# Altium schematic sheet Sheet1.SchDoc
size A4
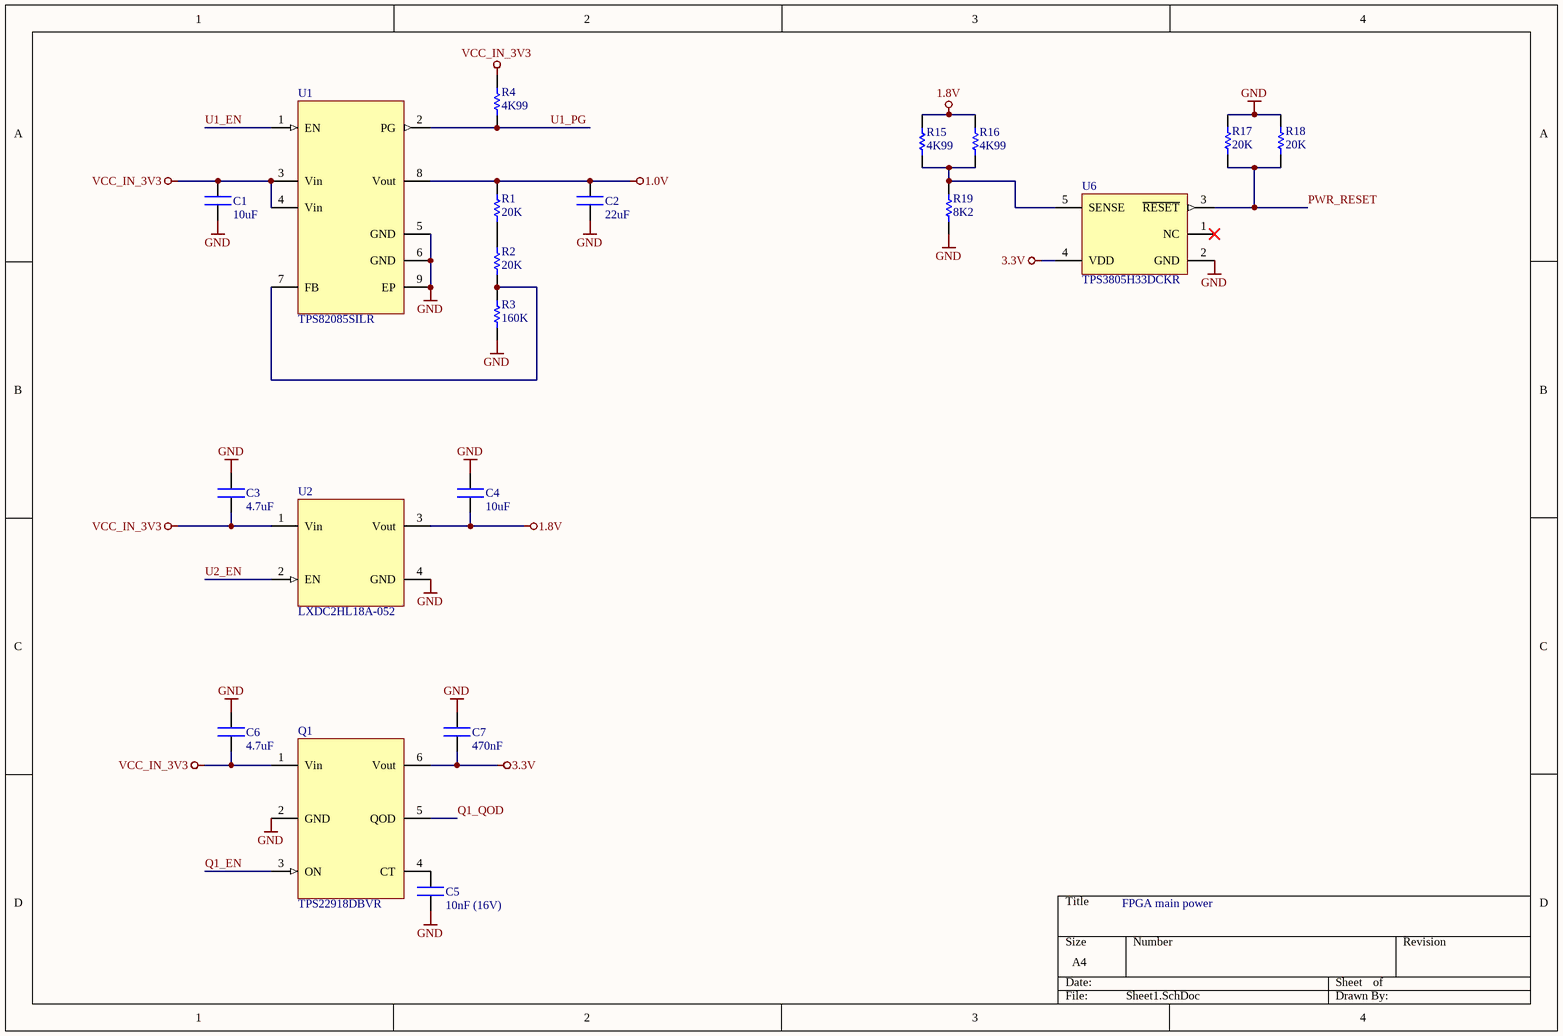
[diagram p0: Sheet1.SchDoc]

## Parts
C1  10uF  [CAPC1608X08N]
C2  22uF  [CAPC1608X08N]
C3  4.7uF  [CAPC1005X05N]
C4  10uF  [CAPC1608X08N]
C5  10nF (16V)  [CAPC1005X05N]
C6  4.7uF  [CAPC1005X05N]
C7  470nF  [CAPC1005X05N]
Q1  TPS22918DBVR  [TPS22918DBVR]
R1  20K  [RESC1005X05N]
R2  20K  [RESC1005X05N]
R3  160K  [RESC1005X05N]
R4  4K99  [RESC1005X05N]
R15  4K99  [RESC1005X05N]
R16  4K99  [RESC1005X05N]
R17  20K  [RESC1005X05N]
R18  20K  [RESC1005X05N]
R19  8K2  [RESC1005X05N]
U1  TPS82085SILR  [TPS82085SILR]
U2  LXDC2HL18A-052  [LXDC2HL18A-052]
U6  TPS3805H33DCKR  [TPS3805H33DCKR]

## Nets
1.0V: C2.2 R1.2 U1.8(Vout)
1.8V: C4.2 R15.2 R16.2 U2.3(Vout)
3.3V: C7.2 Q1.6(Vout) U6.4(VDD)
GND: C1.1 C2.1 C3.1 C4.1 C5.1 C6.1 C7.1 Q1.2(GND) R3.1 R17.1 R18.1 R19.1 U1.5(GND) U1.6(GND) U1.9(EP) U2.4(GND) U6.2(GND)
VCC_IN_3V3: C1.2 C3.2 C6.2 Q1.1(Vin) R4.2 U1.3(Vin) U1.4(Vin) U2.1(Vin)
PWR_RESET: R17.2 R18.2 U6.3(~{RESET})
Q1_EN: Q1.3(ON)
Q1_QOD: Q1.5(QOD)
U1_EN: U1.1(EN)
U1_PG: R4.1 U1.2(PG)
U2_EN: U2.2(EN)
NetC5_2: C5.2 Q1.4(CT)
NetR1_1: R1.1 R2.2
NetR2_1: R2.1 R3.2 U1.7(FB)
NetR15_1: R15.1 R16.1 R19.2 U6.5(SENSE)

Not connected (* = marked no-connect by the designer): U6 1(NC)*

## Notes on the sheet
- FPGA main power

## Library data of the parts
C1 C2 C4 = C0603: Ceramic Chip Capacitor
  C1 C4: Value: 10uF
  C2: Value: 22uF
C3 C5-C7 = C0402: Ceramic Chip Capacitor
  C3 C6: Value: 4.7uF
  C5: Value: 10nF (16V)
  C7: Value: 470nF
Q1 = TPS22918DBVR: 5.5-V, 2-A, 52-mΩ On-Resistance Load Switch
R1-R4 R15-R19 = R0402: Ceramic Chip Resistor
  R1 R2 R17 R18: Value: 20K
  R3: Value: 160K
  R4 R15 R16: Value: 4K99
  R19: Value: 8K2
U1 = TPS82085SILR: 3-A High Efficiency Step-Down Converter
U2 = LXDC2HL18A-052: Low power step-down DC-DC converter.
U6 = TPS3805H33DCKR: Dual Voltage Detector, 2 Supply Monitored, -40 to 85 degC, 5-pin SC70 (DCK), Green (RoHS & no Sb/Br); Manufacturer: Texas Instruments; # of supplies monitored: 2; Iq(Typ)(uA): 3; Output Driver Type / Reset Output: Active-low, Push-pull; Rating: Catalog; Reset Threshold Accuracy(%): 1.5; SubFamily: Supervisor and Reset IC; Threshold Voltage 1 (typ)(Typ)(V): 3.05; Threshold Voltage 2 (typ)(Typ)(V): Adjustable; VCC(Max)(V): 6; VCC(Min)(V): 1.3; DatasheetVersion: SLVS392A; PackageVersion: revG, Jan-2007; PackageReference: DCK5; PackageDescription: 5-Pin Plastic Small-Outline Package, 2 x 1.3 mm Body, 0.65 mm Pitch, 2.1 mm Lead Span; Supplier 1: Digi-Key; Supplier Part Number 1: 296-13407-2-ND; Supplier 2: Digi-Key; Supplier Part Number 2: 296-13407-1-ND; Supplier 3: Digi-Key; Supplier Part Number 3: 296-13407-6-ND; Supplier 4: Newark; Supplier Part Number 4: 77C0394; Supplier 5: Mouser; Supplier Part Number 5: 595-TPS3805H33DCKR; Mounting Technology: Surface Mount; Code_JEDEC: MO-203-AA; PartNumber: TPS3805H33DCKR; ComponentLink1Description: Datasheet; ComponentLink1URL: http://www.ti.com/general/docs/lit/getliterature.tsp?genericPartNumber=TPS3805H33&fileType=pdf